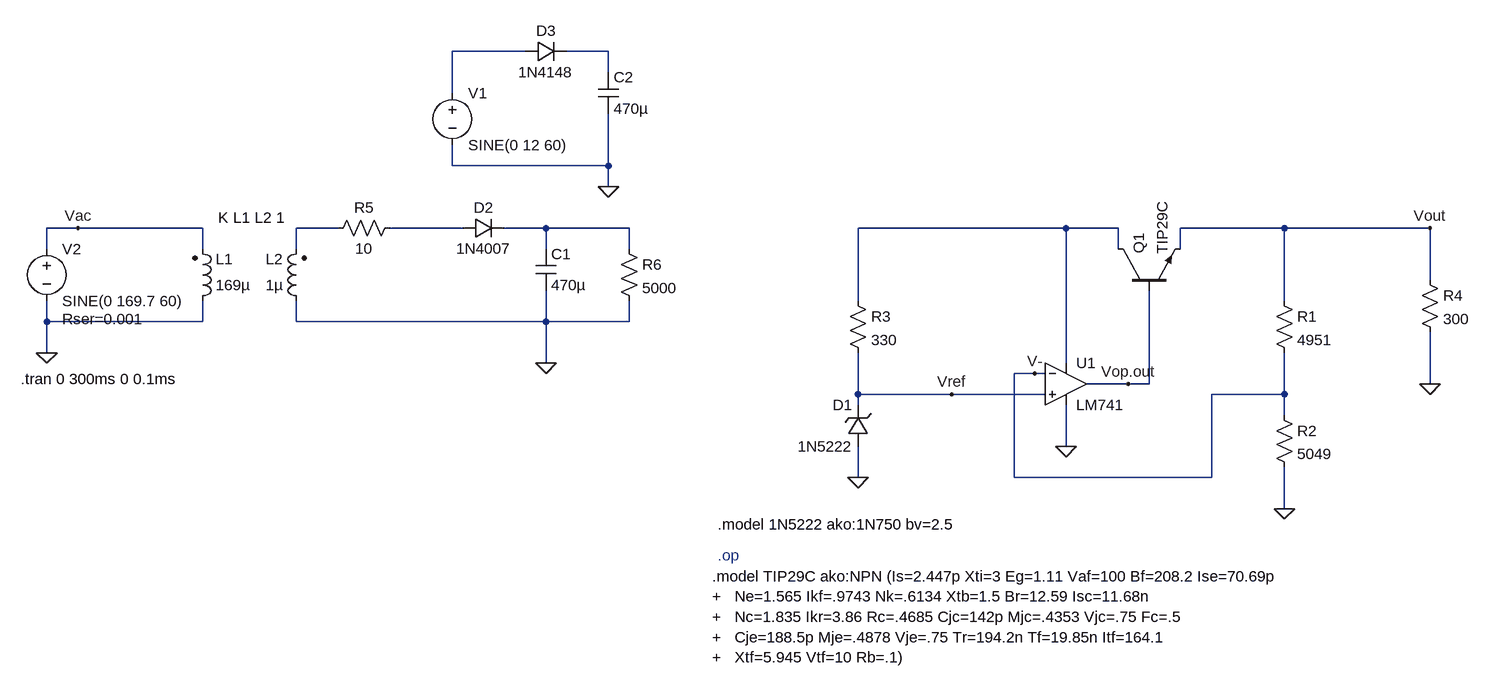
[diagram p0: schematic VReg.asc]
VReg.asc, the LTspice schematic file:
Version 4
SHEET 1 880 680
WIRE -848 -320 -960 -320
WIRE -720 -320 -784 -320
WIRE -720 -288 -720 -320
WIRE -960 -256 -960 -320
WIRE -960 -144 -960 -176
WIRE -720 -144 -720 -224
WIRE -720 -144 -960 -144
WIRE -720 -112 -720 -144
WIRE -1536 -48 -1584 -48
WIRE -1344 -48 -1536 -48
WIRE -1136 -48 -1200 -48
WIRE -944 -48 -1056 -48
WIRE -816 -48 -880 -48
WIRE -688 -48 -816 -48
WIRE -16 -48 -336 -48
WIRE 64 -48 -16 -48
WIRE 320 -48 160 -48
WIRE 544 -48 320 -48
WIRE -1584 -16 -1584 -48
WIRE -1344 -16 -1344 -48
WIRE -1200 -16 -1200 -48
WIRE -816 -16 -816 -48
WIRE -688 -16 -688 -48
WIRE 64 -16 64 -48
WIRE 160 -16 160 -48
WIRE 544 32 544 -48
WIRE -336 64 -336 -48
WIRE 320 64 320 -48
WIRE -1584 96 -1584 64
WIRE -1344 96 -1344 64
WIRE -1344 96 -1584 96
WIRE -1200 96 -1200 64
WIRE -816 96 -816 48
WIRE -816 96 -1200 96
WIRE -688 96 -688 64
WIRE -688 96 -816 96
WIRE -1584 144 -1584 96
WIRE -816 160 -816 96
WIRE -16 160 -16 -48
WIRE -64 176 -96 176
WIRE -48 176 -64 176
WIRE 80 192 16 192
WIRE 112 192 112 48
WIRE 112 192 80 192
WIRE 544 192 544 112
WIRE -336 208 -336 144
WIRE -192 208 -336 208
WIRE -48 208 -192 208
WIRE 320 208 320 144
WIRE 320 208 208 208
WIRE -336 224 -336 208
WIRE 320 240 320 208
WIRE -16 288 -16 224
WIRE -336 336 -336 288
WIRE -96 336 -96 176
WIRE 208 336 208 208
WIRE 208 336 -96 336
WIRE 320 384 320 320
FLAG -336 336 0
FLAG 320 384 0
FLAG 544 192 0
FLAG -192 208 Vref
FLAG -64 176 V-
FLAG 80 192 Vop.out
FLAG 544 -48 Vout
FLAG -16 288 0
FLAG -816 160 0
FLAG -1584 144 0
FLAG -1536 -48 Vac
FLAG -720 -112 0
SYMBOL res 304 48 R0
SYMATTR InstName R1
SYMATTR Value 4951
SYMBOL res 304 224 R0
SYMATTR InstName R2
SYMATTR Value 5049
SYMBOL res -352 48 R0
SYMATTR InstName R3
SYMATTR Value 330
SYMBOL OpAmps\\LM741 -16 128 R0
SYMATTR InstName U1
SYMBOL npn 64 48 R270
SYMATTR InstName Q1
SYMATTR Value TIP29C
SYMBOL zener -320 288 R180
WINDOW 0 24 64 Left 2
WINDOW 3 24 0 Left 2
SYMATTR InstName D1
SYMATTR Value 1N5222
SYMBOL res 528 16 R0
SYMATTR InstName R4
SYMATTR Value 300
SYMBOL voltage -1584 -32 R0
WINDOW 123 0 0 Left 0
WINDOW 39 24 124 Left 2
SYMATTR SpiceLine Rser=0.001
SYMATTR InstName V2
SYMATTR Value SINE(0 169.7 60)
SYMBOL ind2 -1360 80 M180
WINDOW 0 36 80 Left 2
WINDOW 3 36 40 Left 2
SYMATTR InstName L1
SYMATTR Value 169µ
SYMATTR Type ind
SYMBOL ind2 -1184 80 R180
WINDOW 0 36 80 Left 2
WINDOW 3 36 40 Left 2
SYMATTR InstName L2
SYMATTR Value 1µ
SYMATTR Type ind
SYMBOL res -1040 -64 R90
WINDOW 0 0 56 VBottom 2
WINDOW 3 32 56 VTop 2
SYMATTR InstName R5
SYMATTR Value 10
SYMBOL diode -944 -32 R270
WINDOW 0 32 32 VTop 2
WINDOW 3 0 32 VBottom 2
SYMATTR InstName D2
SYMATTR Value 1N4007
SYMBOL cap -832 -16 R0
SYMATTR InstName C1
SYMATTR Value 470µ
SYMBOL diode -848 -304 R270
WINDOW 0 32 32 VTop 2
WINDOW 3 0 32 VBottom 2
SYMATTR InstName D3
SYMATTR Value 1N4148
SYMBOL cap -736 -288 R0
SYMATTR InstName C2
SYMATTR Value 470µ
SYMBOL voltage -960 -272 R0
WINDOW 123 0 0 Left 0
WINDOW 39 0 0 Left 0
SYMATTR InstName V1
SYMATTR Value SINE(0 12 60)
SYMBOL res -704 -32 R0
SYMATTR InstName R6
SYMATTR Value 5000
TEXT -552 408 Left 2 !.model 1N5222 ako:1N750 bv=2.5
TEXT -560 488 Left 2 !.model TIP29C ako:NPN (Is=2.447p Xti=3 Eg=1.11 Vaf=100 Bf=208.2 Ise=70.69p\n+   Ne=1.565 Ikf=.9743 Nk=.6134 Xtb=1.5 Br=12.59 Isc=11.68n\n+   Nc=1.835 Ikr=3.86 Rc=.4685 Cjc=142p Mjc=.4353 Vjc=.75 Fc=.5\n+   Cje=188.5p Mje=.4878 Vje=.75 Tr=194.2n Tf=19.85n Itf=164.1\n+   Xtf=5.945 Vtf=10 Rb=.1)
TEXT -552 456 Left 2 ;.op
TEXT -1320 -64 Left 2 !K L1 L2 1
TEXT -1624 184 Left 2 !.tran 0 300ms 0 0.1ms

The netlist it stands for:
* VReg.asc
R1 Vout V- 4951
R2 V- 0 5049
R3 N006 Vref 330
XU1 Vref V- N006 0 Vop.out LM741  ; pins In+ In- V+ V- OUT
Q1 N006 Vop.out Vout 0 TIP29C
D1 0 Vref 1N5222
R4 Vout 0 300
V2 Vac 0 SINE(0 169.7 60) Rser=0.001
L1 0 Vac 169µ
L2 0 N003 1µ
R5 N004 N003 10
D2 N004 N005 1N4007
C1 N005 0 470µ
D3 N001 N002 1N4148
C2 N002 0 470µ
V1 N001 0 SINE(0 12 60)
R6 N005 0 5000
.model D D
.lib standard.dio
.model NPN NPN
.model PNP PNP
.lib standard.bjt
.model 1N5222 ako:1N750 bv=2.5
.model TIP29C ako:NPN (Is=2.447p Xti=3 Eg=1.11 Vaf=100 Bf=208.2 Ise=70.69p
+   Ne=1.565 Ikf=.9743 Nk=.6134 Xtb=1.5 Br=12.59 Isc=11.68n
+   Nc=1.835 Ikr=3.86 Rc=.4685 Cjc=142p Mjc=.4353 Vjc=.75 Fc=.5
+   Cje=188.5p Mje=.4878 Vje=.75 Tr=194.2n Tf=19.85n Itf=164.1
+   Xtf=5.945 Vtf=10 Rb=.1)
* .op
K L1 L2 1
.tran 0 300ms 0 0.1ms
.lib LM741.lib
.backanno
.end